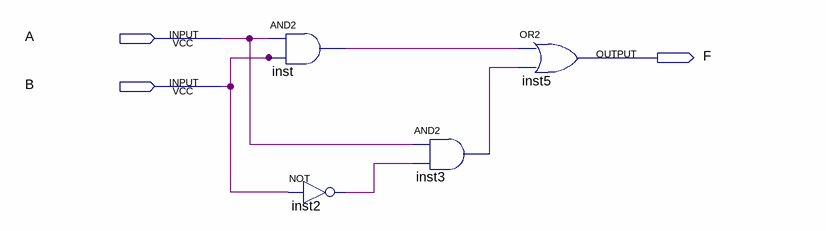
[diagram p0: schematic sheet]
// Quartus schematic Block1.bdf as structural Verilog: 4 symbols, 3 pins
module Block1 (
  input  A,
  input  B,
  output F
);

  wire inst2_out, inst3_out, inst_out;

  and inst (inst_out, A, B);
  not inst2 (inst2_out, B);
  and inst3 (inst3_out, A, inst2_out);
  or inst5 (F, inst_out, inst3_out);
endmodule
